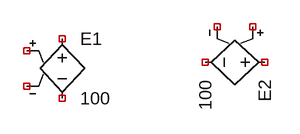
[diagram p0: schematic 07b- bug.asc]
07b- bug.asc, the LTspice schematic file:
Version 4.1
SHEET 1 1876 3832
SYMBOL e -64 1056 R0
SYMATTR InstName E1
SYMATTR Value 100
SYMBOL e 224 1104 R90
SYMATTR InstName E2
SYMATTR Value 100

The netlist it stands for:
* 07b- bug.asc
E1 NC_01 NC_02 NC_03 NC_04 100
E2 NC_05 NC_06 NC_07 NC_08 100
.backanno
.end